# Altium schematic sheet AVR16 BlueBoard.SchDoc: AVR SUMMER
size A4; CheckedBy: Tran Tuan; Author: Tran Tuan; CompanyName: Vnelektronics Co.,Ltd; DrawnBy: Tran Tuan; Engineer: Tran Tuan; Organization: Vnelektronics Co.,Ltd; Address1: 776 Ton Duc Thang; Address2: Lien Chieu, Da Nang; Revision: 1.0; SheetNumber: 02; SheetTotal: 02; ProjectName: AVR Development Kit
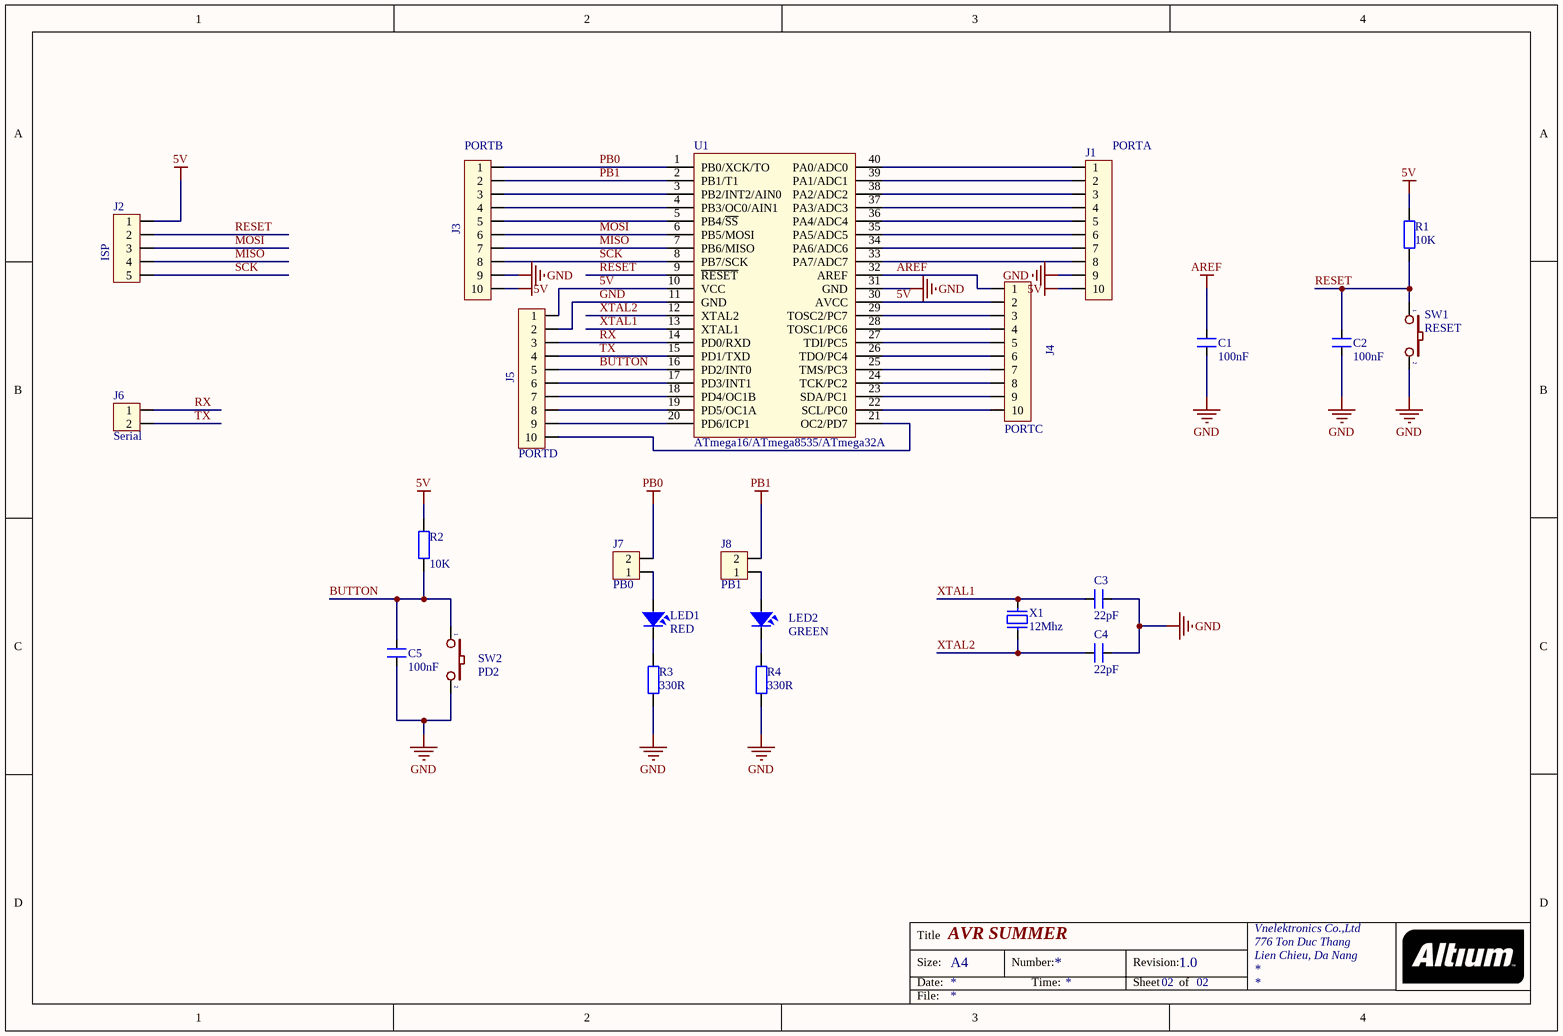
[diagram p0: AVR16 BlueBoard.SchDoc]

## Parts
C1  100nF  [C0805]
C2  100nF  [C0805]
C3  22pF  [C0603]
C4  22pF  [C0603]
C5  100nF  [C0805]
J1  PORTA  [Header_10]
J2  ISP  [Header_5]
J3  PORTB  [Header_10]
J4  PORTC  [Header_10]
J5  PORTD  [Header_10]
J6  Serial  [Header_2]
J7  PB0  [Header_2]
J8  PB1  [Header_2]
LED1  RED  [Led 0805R]
LED2  GREEN  [Led 0805G]
R1  value 10K  [RESC2012(0805)]  (hidden comment: Res2)
R2  value 10K  [RESC2012(0805)]  (hidden comment: Res2)
R3  value 330R  [RESC2012(0805)]  (hidden comment: Res2)
R4  value 330R  [RESC2012(0805)]  (hidden comment: Res2)
SW1  RESET  [BUTTON 2PIN TRON]
SW2  PD2  [BUTTON 2PIN TRON]
U1  ATmega16/ATmega8535/ATmega32A  [de gat xanh dip 40]
X1  12Mhz  [CRYSTAL]

## Nets
5V: J1.10 J2.1 J3.10 J4.2 J5.1 R1.2 R2.2 U1.10(VCC) U1.30(AVCC)
AREF: C1.2 J4.1 U1.32(AREF)
GND: C1.1 C2.2 C3.1 C4.1 C5.2 J1.9 J3.9 J5.2 R3.2 R4.2 SW1.2 SW2.2 U1.11(GND) U1.31(GND)
PB0: J3.1 J7.2 U1.1(PB0/XCK/TO)
PB1: J3.2 J8.2 U1.2(PB1/T1)
BUTTON: C5.1 J5.5 R2.1 SW2.1 U1.16(PD2/INT0)
MISO: J2.4 J3.7 U1.7(PB6/MISO)
MOSI: J2.3 J3.6 U1.6(PB5/MOSI)
RESET: C2.1 J2.2 R1.1 SW1.1 U1.9(~{RESET})
RX: J5.3 J6.1 U1.14(PD0/RXD)
SCK: J2.5 J3.8 U1.8(PB7/SCK)
TX: J5.4 J6.2 U1.15(PD1/TXD)
XTAL1: C3.2 U1.13(XTAL1) X1.1
XTAL2: C4.2 U1.12(XTAL2) X1.2
NetJ1_1: J1.1 U1.40(PA0/ADC0)
NetJ1_2: J1.2 U1.39(PA1/ADC1)
NetJ1_3: J1.3 U1.38(PA2/ADC2)
NetJ1_4: J1.4 U1.37(PA3/ADC3)
NetJ1_5: J1.5 U1.36(PA4/ADC4)
NetJ1_6: J1.6 U1.35(PA5/ADC5)
NetJ1_7: J1.7 U1.34(PA6/ADC6)
NetJ1_8: J1.8 U1.33(PA7/ADC7)
NetJ3_3: J3.3 U1.3(PB2/INT2/AIN0)
NetJ3_4: J3.4 U1.4(PB3/OC0/AIN1)
NetJ3_5: J3.5 U1.5(PB4/~{SS})
NetJ4_3: J4.3 U1.29(TOSC2/PC7)
NetJ4_4: J4.4 U1.28(TOSC1/PC6)
NetJ4_5: J4.5 U1.27(TDI/PC5)
NetJ4_6: J4.6 U1.26(TDO/PC4)
NetJ4_7: J4.7 U1.25(TMS/PC3)
NetJ4_8: J4.8 U1.24(TCK/PC2)
NetJ4_9: J4.9 U1.23(SDA/PC1)
NetJ4_10: J4.10 U1.22(SCL/PC0)
NetJ5_6: J5.6 U1.17(PD3/INT1)
NetJ5_7: J5.7 U1.18(PD4/OC1B)
NetJ5_8: J5.8 U1.19(PD5/OC1A)
NetJ5_9: J5.9 U1.20(PD6/ICP1)
NetJ5_10: J5.10 U1.21(OC2/PD7)
NetJ7_1: J7.1 LED1.1
NetJ8_1: J8.1 LED2.1
NetLED1_2: LED1.2 R3.1
NetLED2_2: LED2.2 R4.1

## Notes on the sheet
- Title
- Size:
- Date:
- A4
- Number:
- Time:
- Revision:
- Sheet
- of
- File:

## Library data of the parts
C1-C5 = CN1: Cap np  1pF - 472pF; Value: 100pF
J1 J3-J5 = Hed10: Header 10; Value: Header 5
J2 = Hed5: Header 5 (Green); Value: Header 5
J6-J8 = Hed2: Header 2 (Green); Value: Header 2
LED1 LED2 = LED: LED Single colour Green and Red; Value: LED 3 ly Single Colour
R1-R4 = Res2: Resistor; Published: 8-Jun-2000; LatestRevisionDate: 17-Jul-2002; LatestRevisionNote: Re-released for DXP Platform.; PackageReference: AXIAL-0.4; Publisher: Altium Limited; PackageDescription: Axial Device, Thru-Hole; 2 Leads; 0.4 in Pin Spacing
SW1 SW2 = SW2: Switch button 2 pin; Value: SW chip 2 pin
U1 = Atmega16L: 8-Bit AVR Microcontroller with 16K Bytes of In-System Programmable Flash Memory; Value: Atmega 16L
X1 = XT2: Crystal For all Crystal 2pin.; Value: 4Mhz